# EAGLE design rc2014_I2c_ctrl&clock (EAGLE 7.6.0)
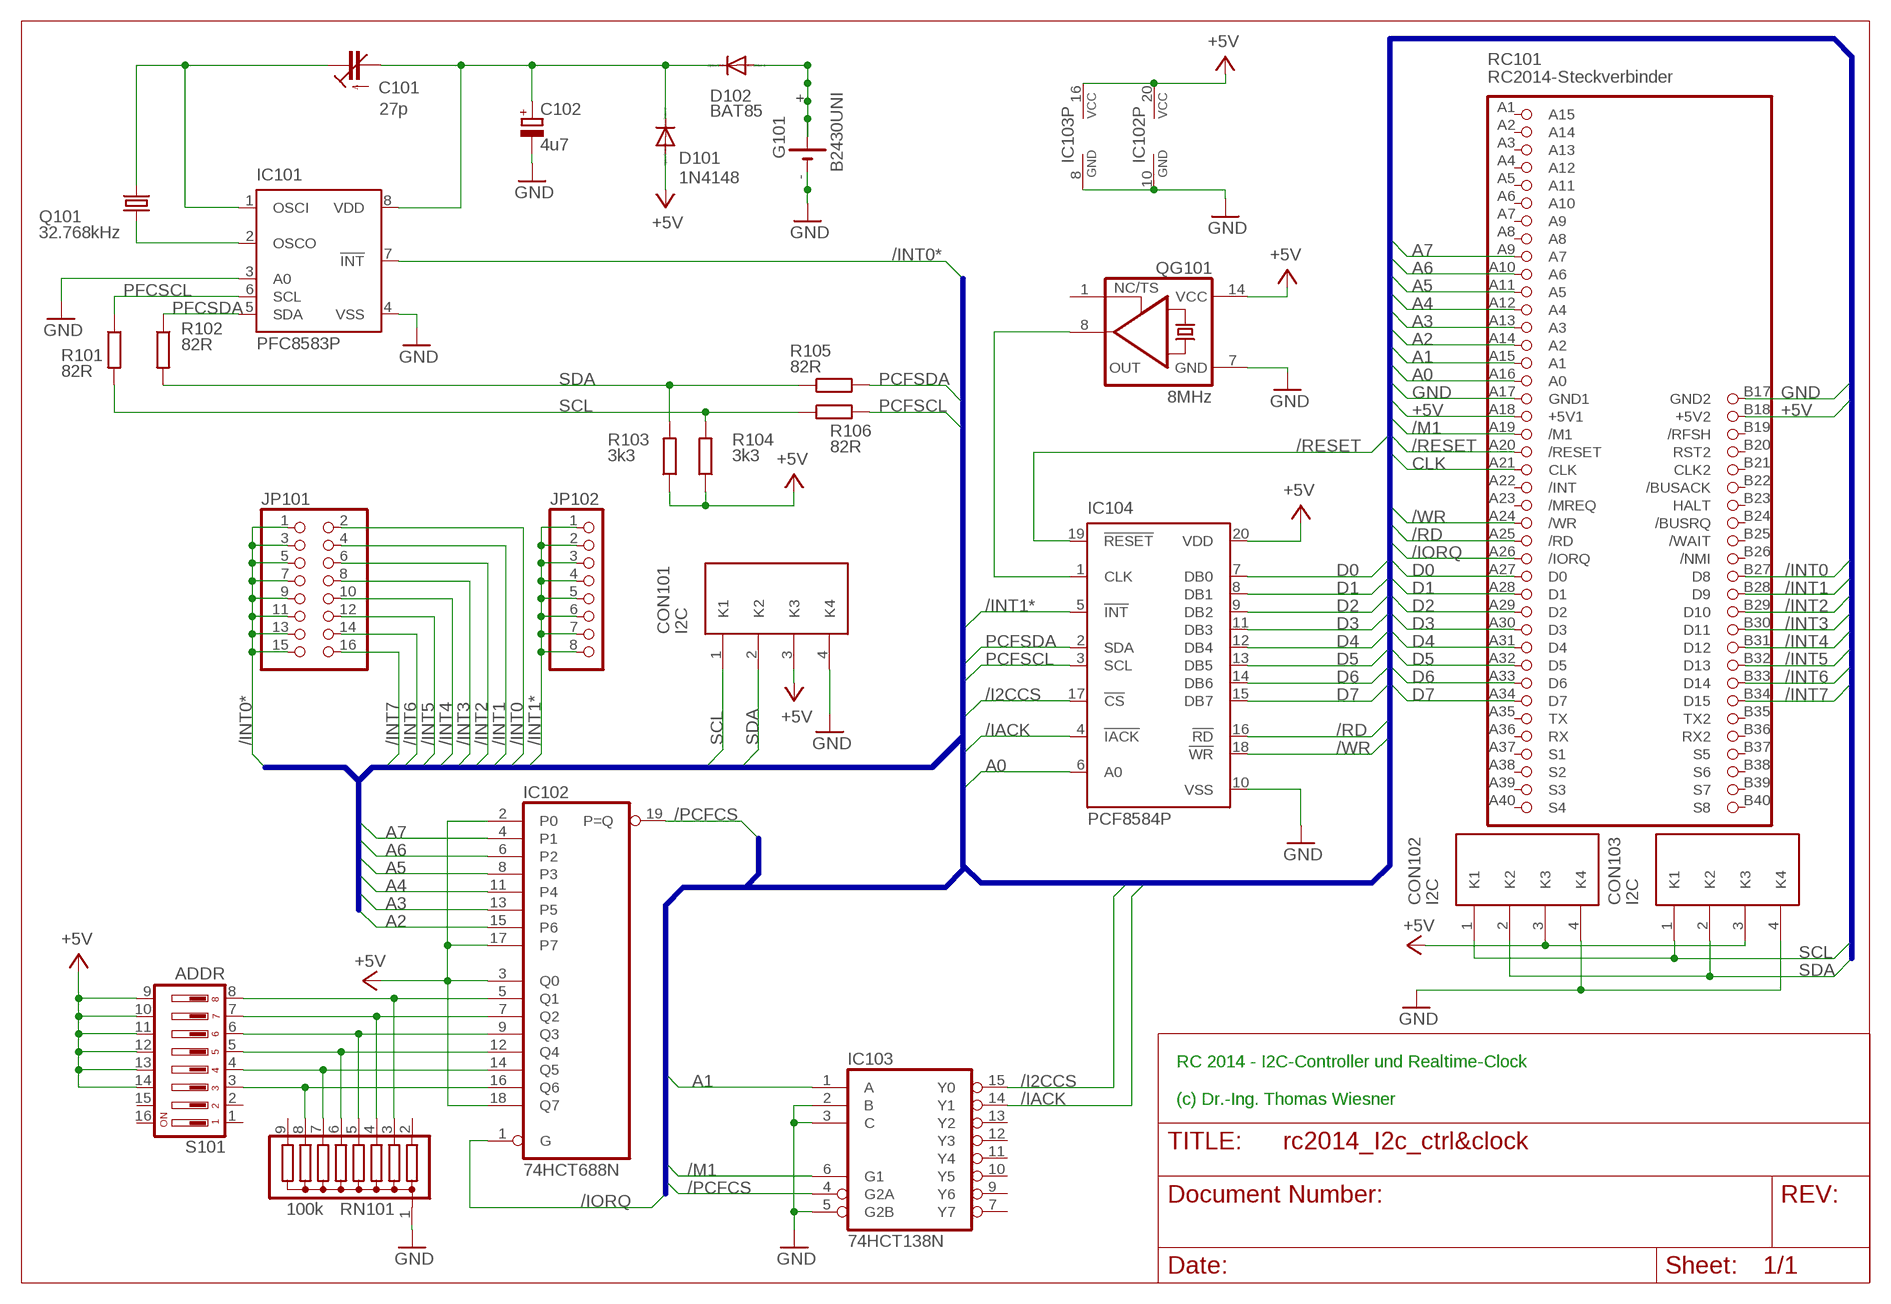
[diagram p0: schematic, sheet 1]

## Parts
C101  27p  C-TRIMM3050.504  [CTRIM3050.504]
C102  4u7  CPOL-EUE2.5-6  [E2,5-6]
CON101  I2C  SEEED-GROVE  [JST-04-ST90]
CON102  I2C  SEEED-GROVE  [JST-04-ST90]
CON103  I2C  SEEED-GROVE  [JST-04-ST90]
D101  1N4148  1N4148DO35-7  [DO35-7]
D102  BAT85  BAT81  [DO34-7]
G101  B2430UNI  [B2430UNI]
IC101  PFC8583P  [DIL08]
IC102  74HCT688N  [DIL20]
IC103  74HCT138N  74ACT138N  [DIL16]
IC104  PCF8584P  [DIL20]
JP101  PINHD-2X8  [2X08]
JP102  PINHD-1X8  [1X08]
Q101  32.768kHz  CRYSTALTC26H  [TC26H]
QG101  8MHz  XO-14  [DIL14S]
R101  82R  R-EU_0207/10  [0207/10]
R102  82R  R-EU_0207/10  [0207/10]
R103  3k3  R-EU_0207/10  [0207/10]
R104  3k3  R-EU_0207/10  [0207/10]
R105  82R  R-EU_0207/10  [0207/10]
R106  82R  R-EU_0207/10  [0207/10]
RC101  RC2014-Steckverbinder  RC2014STECKER  [RC2014-STECKER]
RN101  100k  G08R  [SIL9]
S101  ADDR  DS08  [DS-08]

## Nets
+5V: CON101.3(K3) CON102.3(K3) CON103.3(K3) D101.A IC102.2(P0) IC102.3(Q0) IC102.17(P7) IC102.18(Q7) IC102.20(VCC) IC103.16(VCC) IC104.20(VDD) QG101.14(VCC) R103.1 R104.1 RC101.A18(+5V1) RC101.B18(+5V2) S101.9 S101.10 S101.11 S101.12 S101.13 S101.14
/I2CCS: IC103.15(Y0) IC104.17(!CS)
/IACK: IC103.14(Y1) IC104.4(!IACK)
/INT0: JP101.2 RC101.B27(D8)
/INT0*: IC101.7(!INT) JP101.1 JP101.3 JP101.5 JP101.7 JP101.9 JP101.11 JP101.13 JP101.15
/INT1: JP101.4 RC101.B28(D9)
/INT1*: IC104.5(!INT) JP102.1 JP102.2 JP102.3 JP102.4 JP102.5 JP102.6 JP102.7 JP102.8
/INT2: JP101.6 RC101.B29(D10)
/INT3: JP101.8 RC101.B30(D11)
/INT4: JP101.10 RC101.B31(D12)
/INT5: JP101.12 RC101.B32(D13)
/INT6: JP101.14 RC101.B33(D14)
/INT7: JP101.16 RC101.B34(D15)
/IORQ: IC102.1(G) RC101.A26(/IORQ)
/M1: IC103.6(G1) RC101.A19(/M1)
/PCFCS: IC102.19(P=Q) IC103.4(G2A)
/RD: IC104.16(!RD) RC101.A25(/RD)
/RESET: IC104.19(!RESET) RC101.A20(/RESET)
/WR: IC104.18(!WR) RC101.A24(/WR)
A0: IC104.6(A0) RC101.A16(A0)
A1: IC103.1(A) RC101.A15(A1)
A2: IC102.15(P6) RC101.A14(A2)
A3: IC102.13(P5) RC101.A13(A3)
A4: IC102.11(P4) RC101.A12(A4)
A5: IC102.8(P3) RC101.A11(A5)
A6: IC102.6(P2) RC101.A10(A6)
A7: IC102.4(P1) RC101.A9(A7)
CLK: RC101.A21(CLK)
D0: IC104.7(DB0) RC101.A27(D0)
D1: IC104.8(DB1) RC101.A28(D1)
D2: IC104.9(DB2) RC101.A29(D2)
D3: IC104.11(DB3) RC101.A30(D3)
D4: IC104.12(DB4) RC101.A31(D4)
D5: IC104.13(DB5) RC101.A32(D5)
D6: IC104.14(DB6) RC101.A33(D6)
D7: IC104.15(DB7) RC101.A34(D7)
GND: C102.- CON101.4(K4) CON102.4(K4) CON103.4(K4) G101.- G101.-@1(-) IC101.3(A0) IC101.4(VSS) IC102.10(GND) IC103.2(B) IC103.3(C) IC103.5(G2B) IC103.8(GND) IC104.10(VSS) QG101.7(GND) RC101.A17(GND1) RC101.B17(GND2) RN101.1
N$1: IC104.1(CLK) QG101.8(OUT)
N$3: IC101.2(OSCO) Q101.1
N$4: D102.A G101.+ G101.+@1(+) G101.+@2(+) G101.+@3(+) G101.+@4(+)
N$6: IC102.16(Q6) RN101.8 S101.3
N$7: IC102.14(Q5) RN101.7 S101.4
N$8: IC102.12(Q4) RN101.6 S101.5
N$9: IC102.9(Q3) RN101.5 S101.6
N$10: IC102.7(Q2) RN101.4 S101.7
N$11: IC102.5(Q1) RN101.3 S101.8
N$53: C101.1(E) IC101.1(OSCI) Q101.2
PCFSCL: IC104.3(SCL) R106.2
PCFSDA: IC104.2(SDA) R105.2
PFCSCL: IC101.6(SCL) R101.1
PFCSDA: IC101.5(SDA) R102.1
SCL: CON101.1(K1) CON102.1(K1) CON103.1(K1) R101.2 R104.2 R106.1
SDA: CON101.2(K2) CON102.2(K2) CON103.2(K2) R102.2 R103.2 R105.1
UBATT: C101.2(A) C102.+ D101.C D102.C IC101.8(VDD)
Unconnected: IC103.7(Y7) IC103.9(Y6) IC103.10(Y5) IC103.11(Y4) IC103.12(Y3) IC103.13(Y2) QG101.1(TS) RC101.A1(A15) RC101.A2(A14) RC101.A3(A13) RC101.A4(A12) RC101.A5(A11) RC101.A6(A10) RC101.A7(A9) RC101.A8 RC101.A22(/INT) RC101.A23(/MREQ) RC101.A35(TX) RC101.A36(RX) RC101.A37(S1) RC101.A38(S2) RC101.A39(S3) RC101.A40(S4) RC101.B19(/RFSH) RC101.B20(RST2) RC101.B21(CLK2) RC101.B22(/BUSACK) RC101.B23(HALT) RC101.B24(/BUSRQ) RC101.B25(/WAIT) RC101.B26(/NMI) RC101.B35(TX2) RC101.B36(RX2) RC101.B37(S5) RC101.B38(S6) RC101.B39(S7) RC101.B40(S8) RN101.2 RN101.9 S101.1 S101.2 S101.15 S101.16

## Buses
B$1
B$2

## Notes on the sheet
- RC 2014 - I2C-Controller und Realtime-Clock
  
  (c) Dr.-Ing. Thomas Wiesner

## Library data of the parts
C101 = rcl:C-TRIMM: Trimm capacitor
C102 = rcl:CPOL-EU: POLARIZED CAPACITOR, European symbol
CON101-CON103 = mbc:SEEED-GROVE: SEEED GROVE I2C Steckverbinder
D101 = diode:1N4148: DIODE high speed (Philips)
D102 = diode:BAT81: DIODE barrier diode
G101 = battery:B2430UNI: LI BATTERY
IC101 = micro-philips:PFC8583: I2C-Bus CLOCK/CALENDAR; OC_FARNELL: unknown; OC_NEWARK: unknown
IC102 = 74xx-eu:74*688: 8-bit MAGNITUDE/IDENTITY COMPARATOR, totem pole
IC103 = 74xx-eu:74*138: 3-line to 8-line DECODER/DEMULTIPLEXER
IC104 = micro-philips:PCF8584: I2C-Bus CONTROLLER; MF: FARNELL; MPN: PCF8584P,112; OC_FARNELL: 8906220; OC_NEWARK: 18K6671
JP101 = pinhead:PINHD-2X8: PIN HEADER
JP102 = pinhead:PINHD-1X8: PIN HEADER
Q101 = crystal:CRYSTAL: CRYSTAL; OC_FARNELL: unknown; OC_NEWARK: unknown
QG101 = crystal:XO-: CRYSTAL; OC_FARNELL: unknown; OC_NEWARK: unknown
R101-R106 = resistor:R-EU_: RESISTOR, European symbol
RC101 = mbc:RC2014: RC-2014-Steckverbinder Modul
RN101 = resistor-sil:G08R: SIL RESISTOR; OC_FARNELL: unknown; OC_NEWARK: unknown
S101 = switch-dil:DS08: DIL/CODE SWITCH; MPN: DS08; OC_FARNELL: unknown; OC_NEWARK: 73J0071

## Board
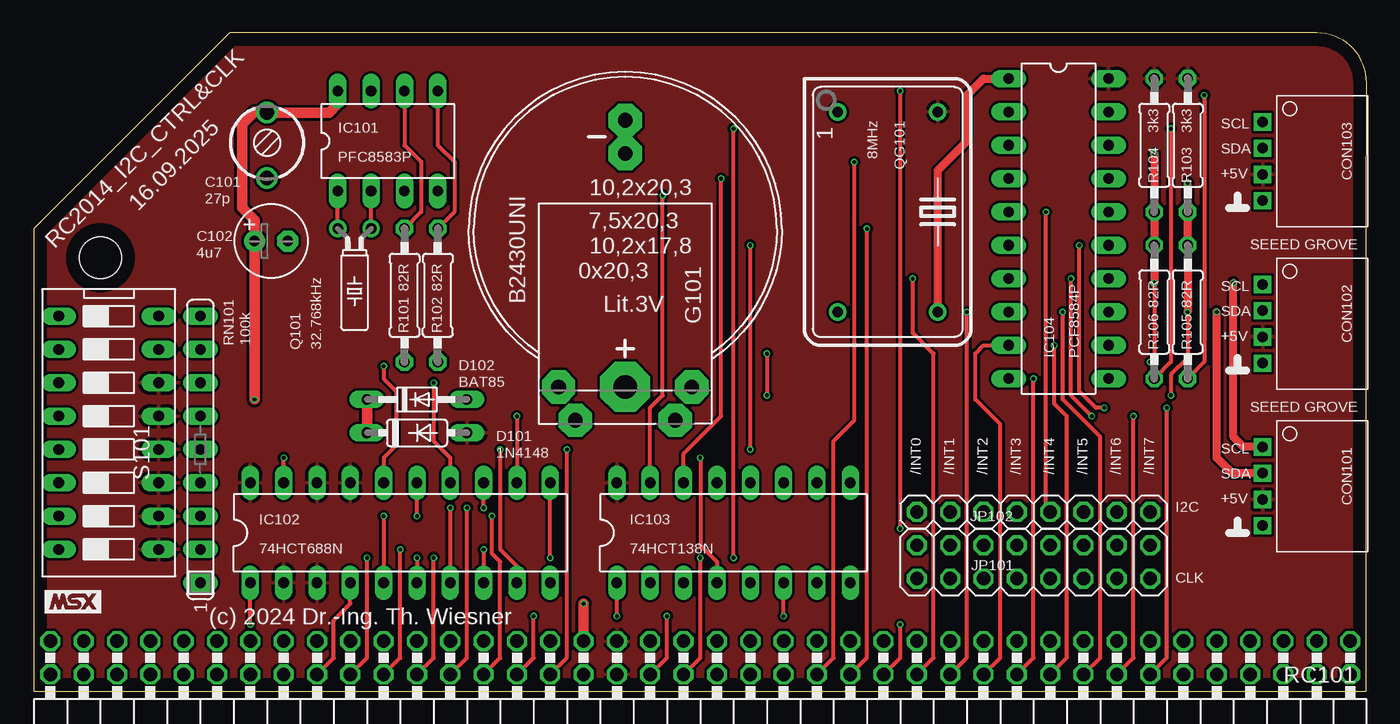
[diagram p1: board, top side]
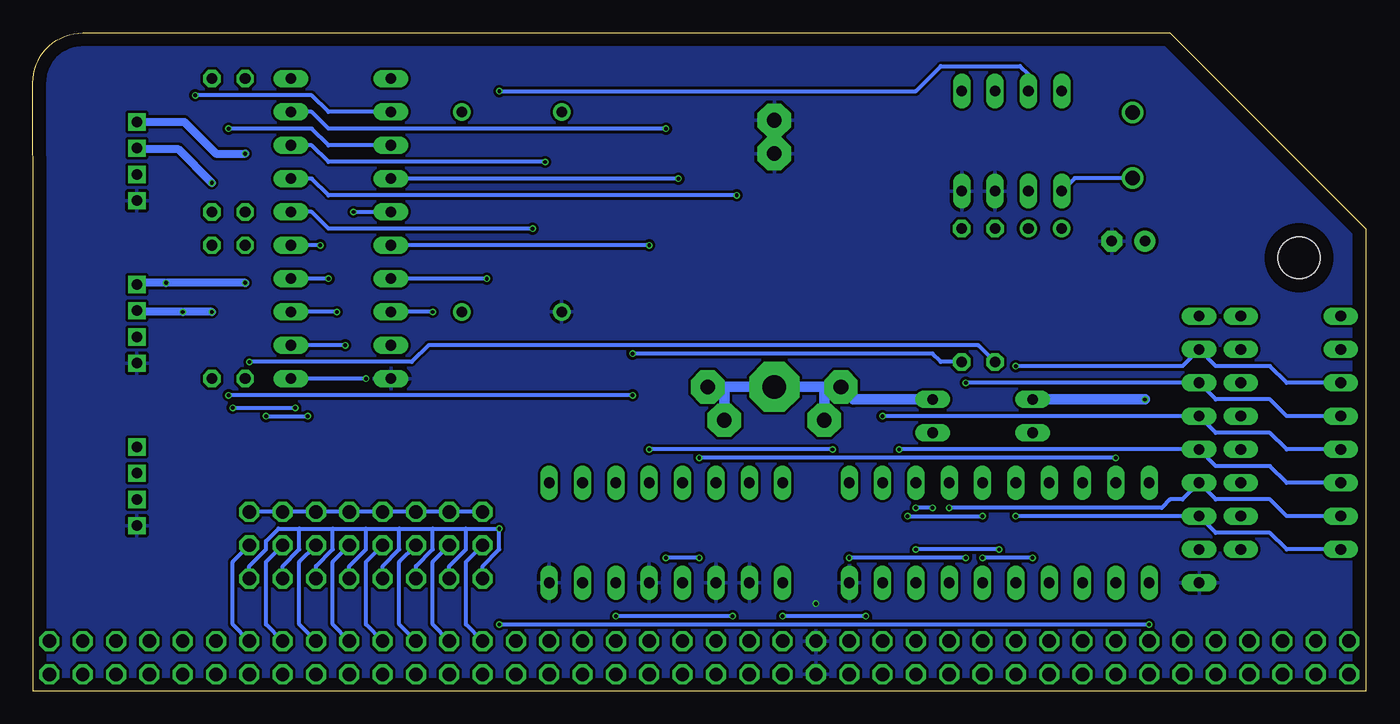
[diagram p2: board, bottom side, seen from below]

Size 101.6 x 50.16 mm. Coordinates in mm from the lower left corner, seen from the top.
Copper layers (1*16): Top 0.035mm / dielectric 1.5mm / Bottom 0.035mm
Design rules "default *": minimum track width 10mil, minimum drill 0.3mm, track to track 8mil, track to pad 4mil, pad to pad 8mil, via to via 8mil, smd to smd 8mil, copper to edge 40mil, drill to drill 8mil, minimum pad ring 10mil, minimum via ring 4mil, stop-mask expansion 4mil, vias tented up to drill 0mil, thermal gap 10mil

### Footprints (pad centres in the part's own frame; a part is rotated, then mirrored left to right if it is on the bottom)
CTRIM3050.504 = drill 1.1: 1 -2.5,0; 2 2.5,0
E2,5-6 = drill 0.813 pad 1.6: + -1.27,0 | drill 0.813 pad 1.6 octagon: - 1.27,0
JST-04-ST90 = drill 0.8 square: 1 -4,0; 2 -2,0; 3 0,0; 4 2,0
DO35-7 = drill 0.813 long: A 3.81,0; C -3.81,0
DO34-7 = drill 0.813 long: A 3.81,0; C -3.81,0
B2430UNI = drill 1.118 pad 2.54 octagon: + 3.81,14.605; +@1 -3.81,14.605; +@2 -5.08,12.065; +@3 5.08,12.065; - 0,-5.715; -@1 0,-8.255 | drill 1.803 pad 3.81 octagon: +@4 0,12.065
DIL08 = drill 0.813 long: 1 -3.81,-3.81; 2 -1.27,-3.81; 3 1.27,-3.81; 4 3.81,-3.81; 5 3.81,3.81; 6 1.27,3.81; 7 -1.27,3.81; 8 -3.81,3.81
DIL20 = drill 0.813 long: 1 -11.43,-3.81; 2 -8.89,-3.81; 3 -6.35,-3.81; 4 -3.81,-3.81; 5 -1.27,-3.81; 6 1.27,-3.81; 7 3.81,-3.81; 8 6.35,-3.81; 9 8.89,-3.81; 10 11.43,-3.81; 11 11.43,3.81; 12 8.89,3.81; 13 6.35,3.81; 14 3.81,3.81; 15 1.27,3.81; 16 -1.27,3.81; 17 -3.81,3.81; 18 -6.35,3.81; 19 -8.89,3.81; 20 -11.43,3.81
DIL16 = drill 0.813 long: 1 -8.89,-3.81; 2 -6.35,-3.81; 3 -3.81,-3.81; 4 -1.27,-3.81; 5 1.27,-3.81; 6 3.81,-3.81; 7 6.35,-3.81; 8 8.89,-3.81; 9 8.89,3.81; 10 6.35,3.81; 11 3.81,3.81; 12 1.27,3.81; 13 -1.27,3.81; 14 -3.81,3.81; 15 -6.35,3.81; 16 -8.89,3.81
2X08 = drill 1.016 octagon: 1 -8.89,-1.27; 2 -8.89,1.27; 3 -6.35,-1.27; 4 -6.35,1.27; 5 -3.81,-1.27; 6 -3.81,1.27; 7 -1.27,-1.27; 8 -1.27,1.27; 9 1.27,-1.27; 10 1.27,1.27; 11 3.81,-1.27; 12 3.81,1.27; 13 6.35,-1.27; 14 6.35,1.27; 15 8.89,-1.27; 16 8.89,1.27
1X08 = drill 1.016 octagon: 1 -8.89,0; 2 -6.35,0; 3 -3.81,0; 4 -1.27,0; 5 1.27,0; 6 3.81,0; 7 6.35,0; 8 8.89,0
TC26H = drill 0.813: 1 -1.27,0; 2 1.27,0
DIL14S = drill 0.813: 1 -7.62,-3.81; 7 7.62,-3.81; 8 7.62,3.81; 14 -7.62,3.81
0207/10 = drill 0.813 octagon: 1 -5.08,0; 2 5.08,0
RC2014-STECKER = drill 1.016 octagon: A1 -49.53,1.27; A2 -46.99,1.27; A3 -44.45,1.27; A4 -41.91,1.27; A5 -39.37,1.27; A6 -36.83,1.27; A7 -34.29,1.27; A8 -31.75,1.27; A9 -29.21,1.27; A10 -26.67,1.27; A11 -24.13,1.27; A12 -21.59,1.27; A13 -19.05,1.27; A14 -16.51,1.27; A15 -13.97,1.27; A16 -11.43,1.27; A17 -8.89,1.27; A18 -6.35,1.27; A19 -3.81,1.27; A20 -1.27,1.27; A21 1.27,1.27; A22 3.81,1.27; A23 6.35,1.27; A24 8.89,1.27; A25 11.43,1.27; A26 13.97,1.27; A27 16.51,1.27; A28 19.05,1.27; A29 21.59,1.27; A30 24.13,1.27; A31 26.67,1.27; A32 29.21,1.27; A33 31.75,1.27; A34 34.29,1.27; A35 36.83,1.27; A36 39.37,1.27; A37 41.91,1.27; A38 44.45,1.27; A39 46.99,1.27; A40 49.53,1.27; B1 -49.53,3.81; B2 -46.99,3.81; B3 -44.45,3.81; B4 -41.91,3.81; B5 -39.37,3.81; B6 -36.83,3.81; B7 -34.29,3.81; B8 -31.75,3.81; B9 -29.21,3.81; B10 -26.67,3.81; B11 -24.13,3.81; B12 -21.59,3.81; B13 -19.05,3.81; B14 -16.51,3.81; B15 -13.97,3.81; B16 -11.43,3.81; B17 -8.89,3.81; B18 -6.35,3.81; B19 -3.81,3.81; B20 -1.27,3.81; B21 1.27,3.81; B22 3.81,3.81; B23 6.35,3.81; B24 8.89,3.81; B25 11.43,3.81; B26 13.97,3.81; B27 16.51,3.81; B28 19.05,3.81; B29 21.59,3.81; B30 24.13,3.81; B31 26.67,3.81; B32 29.21,3.81; B33 31.75,3.81; B34 34.29,3.81; B35 36.83,3.81; B36 39.37,3.81; B37 41.91,3.81; B38 44.45,3.81; B39 46.99,3.81; B40 49.53,3.81 | hole 3.2: -45.72,33.02
SIL9 = drill 0.813 long: 1 -10.16,0; 2 -7.62,0; 3 -5.08,0; 4 -2.54,0; 5 0,0; 6 2.54,0; 7 5.08,0; 8 7.62,0; 9 10.16,0
DS-08 = drill 0.813 long: 1 -8.89,-3.81; 2 -6.35,-3.81; 3 -3.81,-3.81; 4 -1.27,-3.81; 5 1.27,-3.81; 6 3.81,-3.81; 7 6.35,-3.81; 8 8.89,-3.81; 9 8.89,3.81; 10 6.35,3.81; 11 3.81,3.81; 12 1.27,3.81; 13 -1.27,3.81; 14 -3.81,3.81; 15 -6.35,3.81; 16 -8.89,3.81

### Placement (x,y rotation side)
C101  17.78,41.59 90 top
C102  18.1,34.29 0 top
CON101  93.66,14.61 270 top
CON102  93.66,26.99 270 top
CON103  93.66,39.37 270 top
D101  29.21,19.68 0 top
D102  29.21,22.23 0 top
G101  45.09,35.24 180 top
IC101  26.99,41.91 0 top
IC102  27.94,12.06 0 top
IC103  53.34,12.06 0 top
IC104  78.11,35.24 270 top
JP101  76.2,9.84 0 top
JP102  76.2,13.65 0 top
Q101  24.45,35.24 180 top
QG101  65.09,36.51 270 top
R101  28.26,30.16 270 top
R102  30.8,30.16 270 top
R103  87.95,41.59 270 top
R104  85.41,41.59 270 top
R105  87.95,28.89 270 top
R106  85.41,28.89 270 top
RC101  50.8,0 0 top
RN101  12.7,18.41 90 top
S101  5.71,19.68 270 top

### Tracks (layer width: path | path; a pad name or v marks a point on that pad's centre or on a via)
+5V
  pour Top: 0,0 0,35.24 14.92,50.16 101.6,50.16 101.6,0
/I2CCS  (via drill 0.3)
  Top 0.305: IC103.15 46.99,21.59 47.94,22.54 v47.94,37.78
  Bottom 0.305: v47.94,37.78 79.06,37.78 80.33,39.05 IC104.17
/IACK  (via drill 0.3)
  Top 0.305: IC103.14 49.53,18.1 52.39,20.95 v52.39,39.05
  Bottom 0.305: v52.39,39.05 IC104.4
/INT0
  Bottom 0.305: RC101.B27 68.58,5.08 68.58,9.84 JP101.2
/INT0*  (via drill 0.3)
  Top 0.305: v66.04,12.38 v66.04,45.72
  Bottom 0.305: JP101.3 69.85,9.53 68.58,10.79 68.58,12.38 | JP101.5 72.39,9.53 71.12,10.79 71.12,12.38 | JP101.7 74.93,9.53 73.66,10.79 73.66,12.38 | JP101.9 77.47,9.53 76.2,10.79 76.2,12.38 | JP101.11 80.01,9.53 78.74,10.79 78.74,12.38 | JP101.13 82.55,9.53 81.28,10.79 81.28,12.38 | JP101.15 85.09,9.53 83.82,10.79 83.82,11.43 82.87,12.38 81.28,12.38 | 81.28,12.38 78.74,12.38 | 78.74,12.38 76.2,12.38 | 76.2,12.38 73.66,12.38 | 73.66,12.38 71.12,12.38 | 71.12,12.38 68.58,12.38 | 68.58,12.38 v66.04,12.38 66.04,10.79 67.31,9.53 JP101.1 | v66.04,45.72 34.29,45.72 32.38,47.62 26.35,47.62 25.72,46.99 IC101.7
/INT1
  Bottom 0.305: RC101.B28 71.12,5.08 71.12,9.84 JP101.4
/INT1*  (via drill 0.3)
  Top 0.305: v77.15,36.51 77.15,14.29 JP102.5
  Bottom 0.305: v77.15,36.51 IC104.5 | JP102.1 JP102.2 JP102.3 JP102.4 JP102.5 JP102.6 JP102.7 JP102.8
/INT2
  Bottom 0.305: RC101.B29 73.66,5.08 73.66,9.84 JP101.6
/INT3
  Bottom 0.305: RC101.B30 76.2,5.08 76.2,9.84 JP101.8
/INT4
  Bottom 0.305: RC101.B31 78.74,5.08 78.74,9.84 JP101.10
/INT5
  Bottom 0.305: RC101.B32 81.28,5.08 81.28,9.84 JP101.12
/INT6
  Bottom 0.305: RC101.B33 83.82,5.08 83.82,9.84 JP101.14
/INT7
  Bottom 0.305: RC101.B34 86.36,5.08 86.36,9.84 JP101.16
/IORQ  (via drill 0.3)
  Top 0.305: RC101.A26 66.04,2.54 v66.04,5.08 | v16.51,5.08 IC102.1
  Bottom 0.305: v66.04,5.08 v16.51,5.08
/M1  (via drill 0.3)
  Top 0.305: RC101.A19 48.26,2.54 v48.26,5.71 | v57.15,5.71 IC103.6
  Bottom 0.305: v48.26,5.71 v57.15,5.71
/PCFCS  (via drill 0.3)
  Top 0.305: IC102.19 v19.05,17.78 | v50.8,17.78 50.8,11.11 52.07,9.84 IC103.4
  Bottom 0.305: v19.05,17.78 v50.8,17.78
/RD  (via drill 0.3)
  Top 0.305: RC101.A25 63.5,2.54 v63.5,35.24
  Bottom 0.305: v63.5,35.24 79.06,35.24 80.33,36.51 IC104.16
/RESET  (via drill 0.3)
  Top 0.305: RC101.A20 50.8,2.54 v50.8,10.16 | v53.34,10.16 v53.34,42.86
  Bottom 0.305: v50.8,10.16 v53.34,10.16 | v53.34,42.86 79.06,42.86 80.33,44.13 IC104.19
/WR  (via drill 0.3)
  Top 0.305: RC101.A24 60.96,2.54 60.96,19.05 62.55,20.64 v62.55,40.32
  Bottom 0.305: v62.55,40.32 79.06,40.32 80.33,41.59 IC104.18
A0  (via drill 0.3)
  Top 0.305: RC101.A16 40.64,2.54 v40.64,18.41 | v54.61,18.41 v54.61,33.97
  Bottom 0.305: v40.64,18.41 v54.61,18.41 | v54.61,33.97 IC104.6
A1  (via drill 0.3)
  Top 0.305: RC101.A15 38.1,2.54 v38.1,5.71 | v44.45,5.71 IC103.1
  Bottom 0.305: v38.1,5.71 v44.45,5.71
A2  (via drill 0.3)
  Top 0.305: RC101.A14 35.56,2.54 35.56,9.84 34.92,10.48 v34.92,13.34 | v29.21,13.34 IC102.15
  Bottom 0.305: v34.92,13.34 v29.21,13.34
A3  (via drill 0.3)
  Top 0.305: RC101.A13 33.02,2.54 v33.02,13.97 | v34.29,13.97 IC102.13
  Bottom 0.305: v33.02,13.97 v34.29,13.97
A4  (via drill 0.3)
  Top 0.305: RC101.A12 30.48,2.54 v30.48,10.16 | v39.37,10.16 IC102.11
  Bottom 0.305: v30.48,10.16 v39.37,10.16
A5  (via drill 0.3)
  Top 0.305: RC101.A11 27.94,2.54 v27.94,10.79 | v34.29,10.79 IC102.8
  Bottom 0.305: v27.94,10.79 v34.29,10.79
A6  (via drill 0.3)
  Top 0.305: RC101.A10 25.4,2.54 v25.4,10.16 | v29.21,10.16 IC102.6
  Bottom 0.305: v25.4,10.16 v29.21,10.16
A7
  Top 0.305: RC101.A9 22.86,2.54 22.86,5.4 24.13,6.67 IC102.4
D0  (via drill 0.3)
  Top 0.305: RC101.A27 68.58,2.54 68.58,25.72 66.99,27.3 v66.99,31.43
  Bottom 0.305: v66.99,31.43 IC104.7
D1  (via drill 0.3)
  Top 0.305: RC101.A28 71.12,2.54 v71.12,28.89
  Bottom 0.305: v71.12,28.89 IC104.8
D2
  Top 0.305: RC101.A29 73.66,2.54 73.66,20.32 71.75,22.23 71.75,25.72 72.39,26.35 IC104.9
D3  (via drill 0.3)
  Top 0.305: RC101.A30 76.2,2.54 v76.2,23.81
  Bottom 0.305: v76.2,23.81 IC104.11
D4  (via drill 0.3)
  Top 0.305: RC101.A31 78.74,2.54 78.74,20.95 77.79,21.91 v77.79,26.35
  Bottom 0.305: v77.79,26.35 IC104.12
D5  (via drill 0.3)
  Top 0.305: RC101.A32 81.28,2.54 81.28,19.37 78.42,22.23 v78.42,28.89
  Bottom 0.305: v78.42,28.89 IC104.13
D6  (via drill 0.3)
  Top 0.305: RC101.A33 83.82,2.54 v83.82,20.95 | v80.64,20.95 79.06,22.54 v79.06,31.43
  Bottom 0.305: v83.82,20.95 v80.64,20.95 | v79.06,31.43 IC104.14
D7  (via drill 0.3)
  Top 0.305: RC101.A34 86.36,2.54 v86.36,21.59 | v81.6,21.59 80.96,21.59 79.69,22.86 v79.69,33.97
  Bottom 0.305: v86.36,21.59 v81.6,21.59 | v79.69,33.97 IC104.15
GND  (via drill 0.3)
  Top 0.813: RC101.B17 v41.91,6.67
  pour Bottom: 0,0 0,35.24 14.92,50.16 101.6,50.16 101.6,0
N$1
  Top 0.61: QG101.8 68.9,39.69 71.12,41.91 71.12,45.4 72.39,46.67 IC104.1
N$3
  Top 0.305: Q101.1 IC101.2
N$4
  Bottom 0.813: D102.A 39.05,22.23 G101.+@3 41.27,23.18 | 41.27,23.18 G101.+@4 48.9,23.18 | 48.9,23.18 G101.+@2 | G101.+@1 48.9,23.18 | G101.+ 41.27,23.18
N$6  (via drill 0.3)
  Top 0.305: v26.67,24.77 26.67,23.81 27.62,22.86 27.62,18.73 26.67,17.78 IC102.16
  Bottom 0.305: S101.3 6.03,23.5 7.3,24.77 11.43,24.77 RN101.8 13.97,24.77 v26.67,24.77
N$7  (via drill 0.3)
  Top 0.305: v30.48,23.5 30.48,19.05 31.75,17.78 IC102.14
  Bottom 0.305: S101.4 6.03,20.95 7.3,22.23 11.43,22.23 RN101.7 v30.48,23.5
N$8  (via drill 0.3)
  Top 0.305: v36.83,20.95 IC102.12
  Bottom 0.305: S101.5 6.03,18.41 7.3,19.68 11.43,19.68 RN101.6 v36.83,20.95
N$9  (via drill 0.3)
  Top 0.305: v35.56,18.41 35.56,10.79 36.83,9.53 IC102.9
  Bottom 0.305: S101.6 6.03,15.88 7.3,17.14 11.43,17.14 RN101.5 v35.56,18.41
N$10  (via drill 0.3)
  Top 0.305: v31.75,13.97 IC102.7
  Bottom 0.305: S101.7 6.03,13.34 7.3,14.61 11.43,14.61 RN101.4 13.97,14.61 14.92,14.61 15.56,13.97 v31.75,13.97
N$11  (via drill 0.3)
  Top 0.305: v26.67,13.34 IC102.5
  Bottom 0.305: S101.8 6.03,10.79 7.3,12.06 11.43,12.06 RN101.3 v26.67,13.34
N$53
  Top 0.305: Q101.2 IC101.1
  Bottom 0.305: C101.1 22.18,39.09 IC101.1
PCFSCL  (via drill 0.3)
  Top 0.305: v86.68,42.86 86.68,25.08 R106.2
  Bottom 0.305: IC104.3 79.06,41.59 80.33,42.86 v86.68,42.86
PCFSDA  (via drill 0.3)
  Top 0.305: v89.22,45.4 89.22,25.08 R105.2
  Bottom 0.305: IC104.2 79.06,44.13 80.33,45.4 v89.22,45.4
PFCSCL
  Top 0.305: IC101.6 28.26,41.59 29.53,40.32 29.53,36.51 R101.1
PFCSDA
  Top 0.305: IC101.5 30.8,41.59 32.07,40.32 32.07,36.51 R102.1
SCL  (via drill 0.3)
  Top 0.305: v85.41,31.11 85.41,25.4 v85.09,25.08
  Top 0.61: v85.41,40.96 R104.2 R106.1 v85.41,31.11 | CON101.1 92.2,18.61 91.44,19.37 v91.44,31.11
  Bottom 0.305: R101.2 29.53,26.35 71.44,26.35 72.71,25.08 v85.09,25.08
  Bottom 0.61: CON103.1 90.04,43.37 87.63,40.96 v85.41,40.96 | v85.41,31.11 v91.44,31.11 93.53,31.11 CON102.1
SDA  (via drill 0.3)
  Top 0.305: v55.88,25.72 v55.88,22.54 | v87.95,28.89 87.95,25.4 86.68,24.13 v86.68,22.54
  Top 0.61: v87.95,38.73 R103.2 R105.1 v87.95,28.89 | CON101.2 91.34,16.61 90.17,17.78 v90.17,28.89
  Bottom 0.305: R102.2 32.38,25.08 33.02,25.72 v55.88,25.72 | v55.88,22.54 v86.68,22.54
  Bottom 0.61: v87.95,38.73 90.49,41.27 93.57,41.27 CON103.2 | v87.95,28.89 v90.17,28.89 93.57,28.89 CON102.2
UBATT  (via drill 0.3)
  Top 0.813: v16.83,22.23 C102.+ 16.83,35.88 15.88,36.83 15.88,43.18 16.83,44.13 17.74,44.13 C101.2 22.5,44.09 23.18,44.77 IC101.8 | D101.C D102.C
  Bottom 0.813: D102.C v16.83,22.23

### Text on the board
tNames: SCL | SDA | +5V | 16.09.2025 | RC2014_I2C_CTRL&CLK | SEEED GROVE | SCL | SDA | +5V | SEEED GROVE | SCL | /INT0 | /INT1 | /INT2 | /INT3 | /INT4 | /INT5 | /INT6 | /INT7 | SDA | I2C | +5V | CLK | (c) 2024 Dr.-Ing. Th. Wiesner